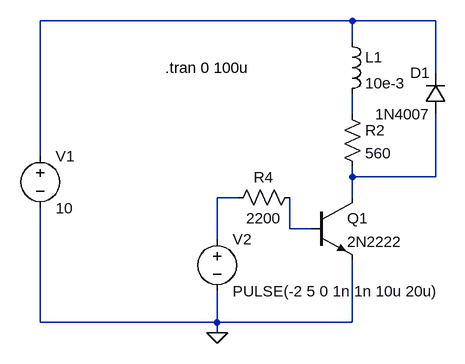
[diagram p0: schematic partbobine.asc]
partbobine.asc, the LTspice schematic file:
Version 4
SHEET 1 880 680
WIRE 608 64 128 64
WIRE 736 64 608 64
WIRE 608 96 608 64
WIRE 736 144 736 64
WIRE 608 208 608 176
WIRE 128 272 128 64
WIRE 608 304 608 288
WIRE 736 304 736 208
WIRE 736 304 608 304
WIRE 432 336 400 336
WIRE 608 336 608 304
WIRE 512 384 512 336
WIRE 544 384 512 384
WIRE 400 400 400 336
WIRE 128 528 128 352
WIRE 400 528 400 480
WIRE 400 528 128 528
WIRE 608 528 608 432
WIRE 608 528 400 528
WIRE 400 544 400 528
FLAG 400 544 0
SYMBOL Voltage 128 256 R0
SYMATTR InstName V1
SYMATTR Value 10
SYMBOL Voltage 400 384 R0
SYMATTR InstName V2
SYMATTR Value PULSE(-2 5 0 1n 1n 10u 20u)
SYMBOL Res 592 192 R0
SYMATTR InstName R2
SYMATTR Value 560
SYMBOL ind 592 80 R0
SYMATTR InstName L1
SYMATTR Value 10e-3
SYMATTR SpiceLine Rser=10
SYMBOL Res 528 320 R90
WINDOW 0 0 56 VBottom 2
WINDOW 3 32 56 VTop 2
SYMATTR InstName R4
SYMATTR Value 2200
SYMBOL npn 544 336 R0
SYMATTR InstName Q1
SYMATTR Value 2N2222
SYMBOL diode 752 208 R180
WINDOW 0 24 64 Left 2
WINDOW 3 24 0 Left 2
SYMATTR InstName D1
SYMATTR Value 1N4007
TEXT 320 136 Left 2 !.tran 0 100u

The netlist it stands for:
* partbobine.asc
V1 N001 0 10
V2 N004 0 PULSE(-2 5 0 1n 1n 10u 20u)
R2 N002 N003 560
L1 N001 N002 10e-3 Rser=10
R4 N005 N004 2200
Q1 N003 N005 0 0 2N2222
D1 N003 N001 1N4007
.model D D
.lib standard.dio
.model NPN NPN
.model PNP PNP
.lib standard.bjt
.tran 0 100u
.backanno
.end